# EAGLE design version3f (EAGLE 9.6.2)
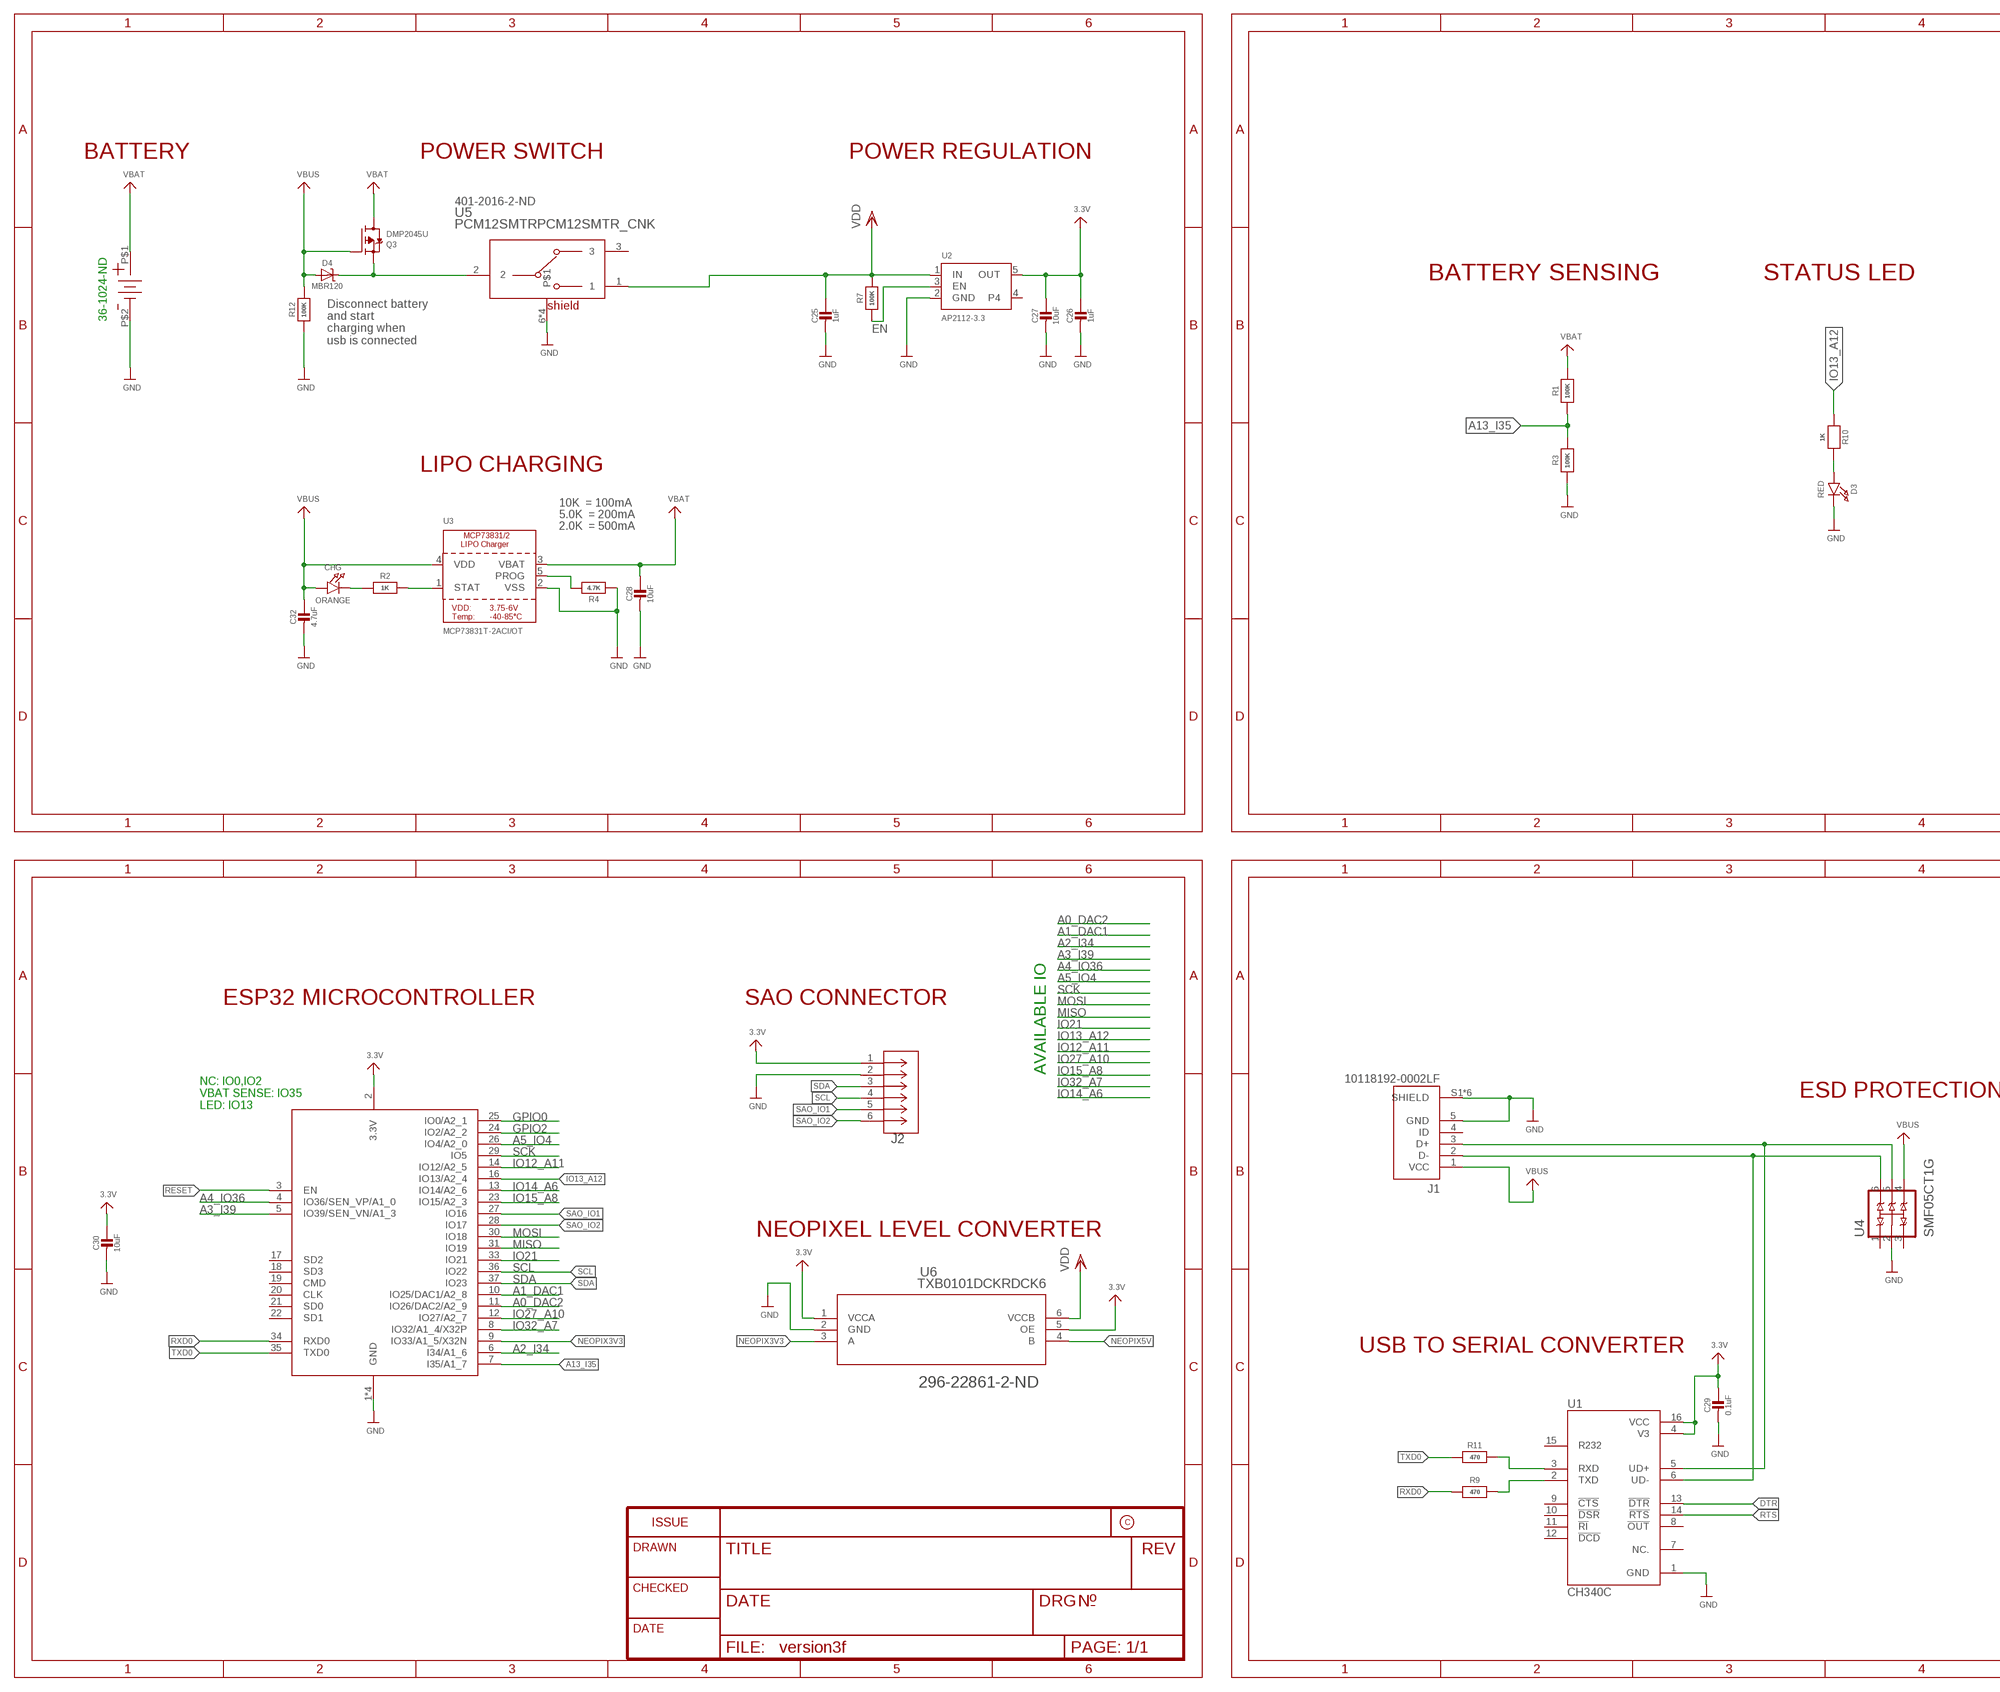
[diagram p0: schematic, sheet 1, part 1 of 2]
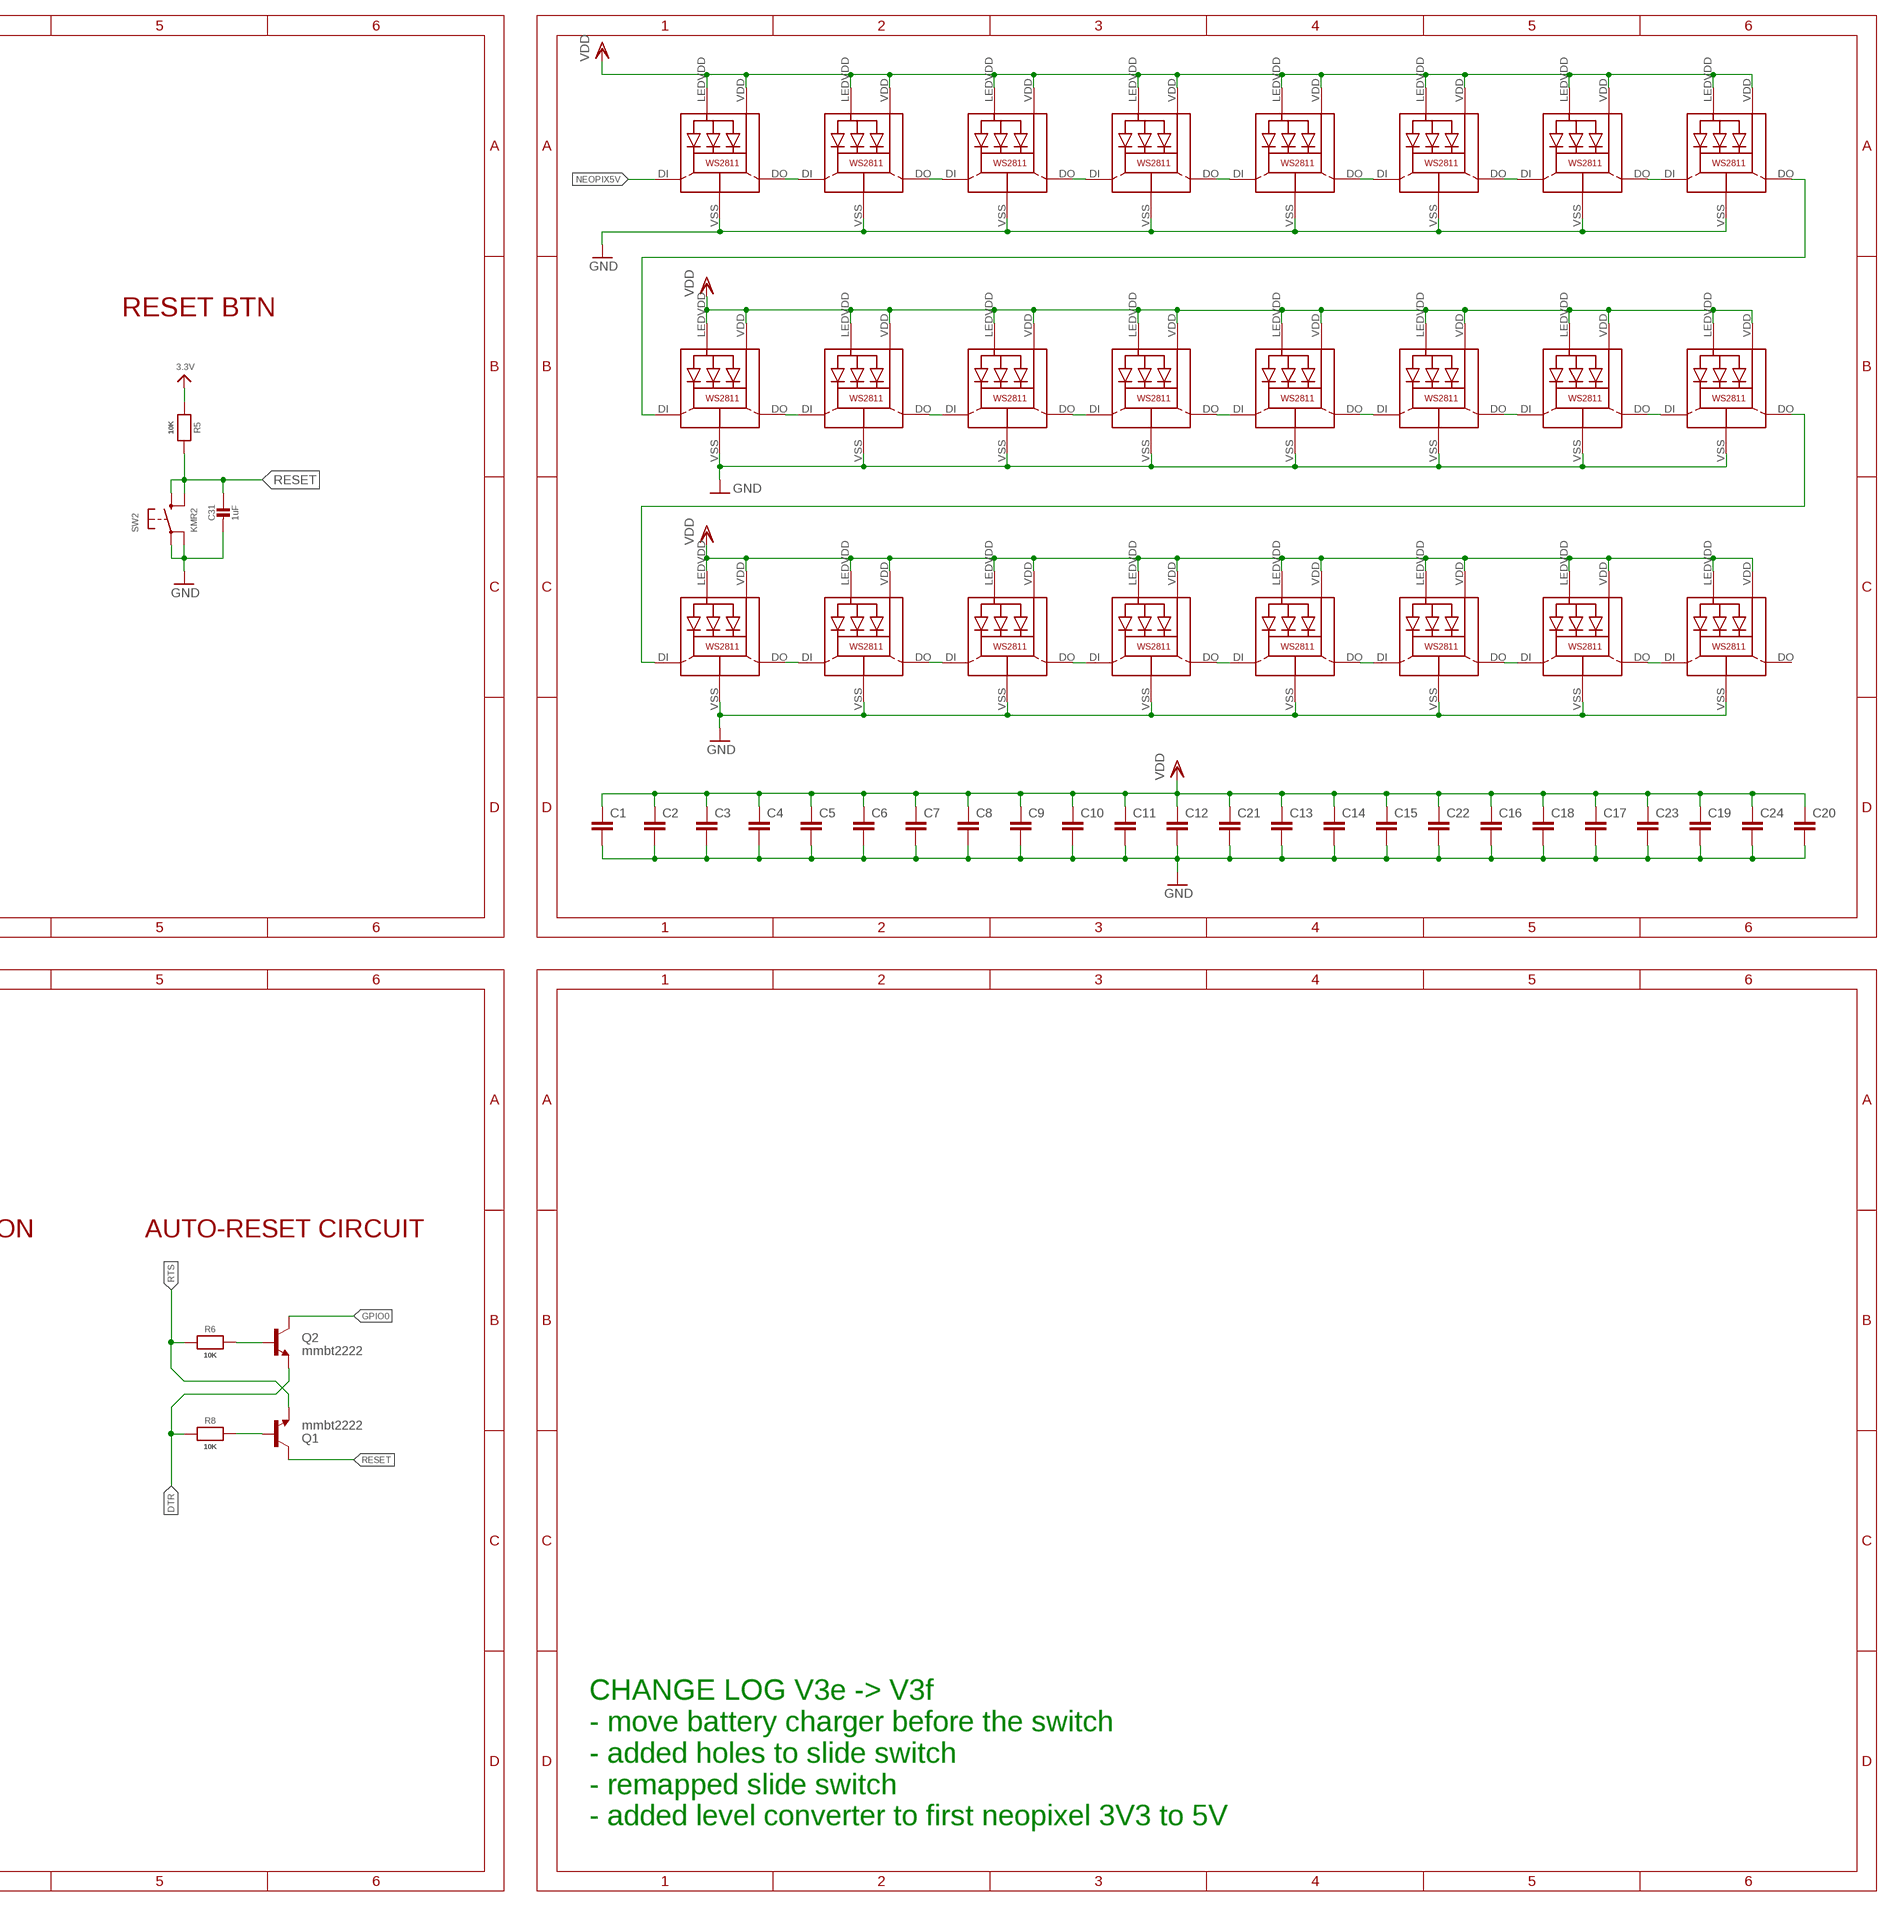
[diagram p1: schematic, sheet 1, part 2 of 2]

## Parts
C1  C-EUC0603  [C0603]
C2  C-EUC0603  [C0603]
C3  C-EUC0603  [C0603]
C4  C-EUC0603  [C0603]
C5  C-EUC0603  [C0603]
C6  C-EUC0603  [C0603]
C7  C-EUC0603  [C0603]
C8  C-EUC0603  [C0603]
C9  C-EUC0603  [C0603]
C10  C-EUC0603  [C0603]
C11  C-EUC0603  [C0603]
C12  C-EUC0603  [C0603]
C13  C-EUC0603  [C0603]
C14  C-EUC0603  [C0603]
C15  C-EUC0603  [C0603]
C16  C-EUC0603  [C0603]
C17  C-EUC0603  [C0603]
C18  C-EUC0603  [C0603]
C19  C-EUC0603  [C0603]
C20  C-EUC0603  [C0603]
C21  C-EUC0603  [C0603]
C22  C-EUC0603  [C0603]
C23  C-EUC0603  [C0603]
C24  C-EUC0603  [C0603]
C25  1uF  CAP_CERAMIC0805-NOOUTLINE  [0805-NO]
C26  1uF  CAP_CERAMIC0603_NO  [0603-NO]
C27  10uF  CAP_CERAMIC0805-NOOUTLINE  [0805-NO]
C28  10uF  CAP_CERAMIC0805-NOOUTLINE  [0805-NO]
C29  0.1uF  CAP_CERAMIC0805-NOOUTLINE  [0805-NO]
C30  10uF  CAP_CERAMIC0805-NOOUTLINE  [0805-NO]
C31  1uF  CAP_CERAMIC0603_NO  [0603-NO]
C32  4.7uF  CAP_CERAMIC0805-NOOUTLINE  [0805-NO]
CHG  ORANGE  LED0805_NOOUTLINE  [CHIPLED_0805_NOOUTLINE]
D3  RED  LED0805_NOOUTLINE  [CHIPLED_0805_NOOUTLINE]
D4  MBR120  DIODE-SCHOTTKYSOD-123  [SOD-123]
J1  10118192-0002LF  [AMPHENOL_10118192-0002LF]
J2  SSW-103-22-F-D-VS-K-TRCON3_SSW-D-DUMZ_HDR_SAI  [CON3_SSW-D-DUMZ_HDR_SAI]
LED1  WS28115050  [WS28115050]
LED2  WS28115050  [WS28115050]
LED3  WS28115050  [WS28115050]
LED4  WS28115050  [WS28115050]
LED5  WS28115050  [WS28115050]
LED6  WS28115050  [WS28115050]
LED7  WS28115050  [WS28115050]
LED8  WS28115050  [WS28115050]
LED9  WS28115050  [WS28115050]
LED10  WS28115050  [WS28115050]
LED11  WS28115050  [WS28115050]
LED12  WS28115050  [WS28115050]
LED13  WS28115050  [WS28115050]
LED14  WS28115050  [WS28115050]
LED15  WS28115050  [WS28115050]
LED16  WS28115050  [WS28115050]
LED17  WS28115050  [WS28115050]
LED18  WS28115050  [WS28115050]
LED19  WS28115050  [WS28115050]
LED20  WS28115050  [WS28115050]
LED21  WS28115050  [WS28115050]
LED22  WS28115050  [WS28115050]
LED23  WS28115050  [WS28115050]
LED24  WS28115050  [WS28115050]
Q1  mmbt2222  TRANSISTOR_NPNSOT23-3  [SOT23-3]
Q2  mmbt2222  TRANSISTOR_NPNSOT23-3  [SOT23-3]
Q3  DMP2045U  MOSFET-P  [SOT23-R]
R1  100K  RESISTOR_0603_NOOUT  [0603-NO]
R2  1K  RESISTOR_0603_NOOUT  [0603-NO]
R3  100K  RESISTOR_0603_NOOUT  [0603-NO]
R4  4.7K  RESISTOR_0603_NOOUT  [0603-NO]
R5  10K  RESISTOR_0603_NOOUT  [0603-NO]
R6  10K  RESISTOR_0603_NOOUT  [0603-NO]
R7  100K  RESISTOR_0603_NOOUT  [0603-NO]
R8  10K  RESISTOR_0603_NOOUT  [0603-NO]
R9  470  RESISTOR_0603_NOOUT  [0603-NO]
R10  1K  RESISTOR_0603_NOOUT  [0603-NO]
R11  470  RESISTOR_0603_NOOUT  [0603-NO]
R12  100K  RESISTOR_0603_NOOUT  [0603-NO]
SW2  KMR2  SWITCH_TACT_SMT4.6X2.8  [BTN_KMR2_4.6X2.8]
U1  CH340C  [SOIC127P600X180-16N]
U2  AP2112-3.3  VREG_SOT23-5  [SOT23-5]
U3  MCP73831T-2ACI/OT  MCP73831/2  [SOT23-5]
U4  SMF05CT1G  [SOT65P210X110-6N]
U5  PCM12SMTRPCM12SMTR_CNK  [PCM12SMTR_CNK]
U6  TXB0101DCKRDCK6  [DCK6]
U$9  1024TR  [1024TR]
X2  ESP32_WROOM32_SKINNY  [WROOM32_SKINNY]

## Nets
3.3V: C26.1 C27.1 C29.1 C30.1 J2.1 R5.1 U1.4(V3) U1.16(VCC) U2.5(OUT) U6.1(VCCA) U6.5(OE) X2.2(3.3V)
A0_DAC2: X2.11(IO26/DAC2/A2_9)
A1_DAC1: X2.10(IO25/DAC1/A2_8)
A2_I34: X2.6(I34/A1_6)
A3_I39: X2.5(IO39/SEN_VN/A1_3)
A4_IO36: X2.4(IO36/SEN_VP/A1_0)
A5_IO4: X2.26(IO4/A2_0)
A13_I35: R1.1 R3.2 X2.7(I35/A1_7)
DTR: Q2.2(E) R8.1 U1.13(!DTR)
EN: R7.1 U2.3(EN)
GND: C1.2 C2.2 C3.2 C4.2 C5.2 C6.2 C7.2 C8.2 C9.2 C10.2 C11.2 C12.2 C13.2 C14.2 C15.2 C16.2 C17.2 C18.2 C19.2 C20.2 C21.2 C22.2 C23.2 C24.2 C25.2 C26.2 C27.2 C28.2 C29.2 C30.2 C31.2 C32.2 D3.C J1.5(GND) J1.S1(SHIELD) J1.S2(SHIELD) J1.S3(SHIELD) J1.S4(SHIELD) J1.S5(SHIELD) J1.S6(SHIELD) J2.2 LED1.VSS(GND) LED2.VSS(GND) LED3.VSS(GND) LED4.VSS(GND) LED5.VSS(GND) LED6.VSS(GND) LED7.VSS(GND) LED8.VSS(GND) LED9.VSS(GND) LED10.VSS(GND) LED11.VSS(GND) LED12.VSS(GND) LED13.VSS(GND) LED14.VSS(GND) LED15.VSS(GND) LED16.VSS(GND) LED17.VSS(GND) LED18.VSS(GND) LED19.VSS(GND) LED20.VSS(GND) LED21.VSS(GND) LED22.VSS(GND) LED23.VSS(GND) LED24.VSS(GND) R3.1 R4.1 R12.1 SW2.A'(P1) SW2.A(P) U1.1(GND) U2.2(GND) U3.2(VSS) U4.2(A) U5.6 U5.7 U5.8 U5.9 U6.2(GND) U$9.P$2 X2.1(GND) X2.15(GND) X2.38(GND) X2.P$1(GND)
GPIO0: Q2.3(C) X2.25(IO0/A2_1)
GPIO2: X2.24(IO2/A2_2)
IO12_A11: X2.14(IO12/A2_5)
IO13_A12: R10.1 X2.16(IO13/A2_4)
IO14_A6: X2.13(IO14/A2_6)
IO15_A8: X2.23(IO15/A2_3)
IO21: X2.33(IO21)
IO27_A10: X2.12(IO27/A2_7)
IO32_A7: X2.8(IO32/A1_4/X32P)
MISO: X2.31(IO19)
MOSI: X2.30(IO18)
N$1: LED1.DO LED2.DI
N$2: LED2.DO LED3.DI
N$3: LED3.DO LED4.DI
N$4: LED4.DO LED5.DI
N$5: LED5.DO LED6.DI
N$6: LED6.DO LED7.DI
N$7: LED7.DO LED8.DI
N$8: LED8.DO LED9.DI
N$9: LED9.DO LED10.DI
N$10: LED10.DO LED11.DI
N$11: LED11.DO LED12.DI
N$12: LED12.DO LED13.DI
N$13: LED13.DO LED14.DI
N$14: LED14.DO LED15.DI
N$15: LED15.DO LED16.DI
N$16: LED16.DO LED17.DI
N$17: LED17.DO LED18.DI
N$18: LED18.DO LED19.DI
N$19: LED19.DO LED20.DI
N$20: LED20.DO LED21.DI
N$21: LED21.DO LED22.DI
N$22: LED22.DO LED23.DI
N$23: LED23.DO LED24.DI
N$24: CHG.C R2.1
N$25: R2.2 U3.1(STAT)
N$26: R9.2 U1.2(TXD)
N$27: R4.2 U3.5(PROG)
N$28: J1.3(D+) U1.5(UD+) U4.5(C4)
N$29: J1.2(D-) U1.6(UD-) U4.6(C5)
N$30: Q1.1(B) R8.2
N$31: Q2.1(B) R6.2
N$32: R11.2 U1.3(RXD)
N$33: D3.A R10.2
N$34: D4.C Q3.2(S) U5.2
NEOPIX3V3: U6.3(A) X2.9(IO33/A1_5/X32N)
NEOPIX5V: LED1.DI U6.4(B)
RESET: C31.1 Q1.3(C) R5.2 SW2.B'(S1) SW2.B(S) X2.3(EN)
RTS: Q1.2(E) R6.1 U1.14(!RTS)
RXD0: R9.1 X2.34(RXD0)
SAO_IO1: J2.5 X2.27(IO16)
SAO_IO2: J2.6 X2.28(IO17)
SCK: X2.29(IO5)
SCL: J2.4 X2.36(IO22)
SDA: J2.3 X2.37(IO23)
TXD0: R11.1 X2.35(TXD0)
VBAT: C28.1 Q3.3(D) R1.2 U3.3(VBAT) U$9.P$1
VBUS: C32.1 CHG.A D4.A J1.1(VCC) Q3.1(G) R12.2 U3.4(VDD) U4.4(C3)
VDD: C1.1 C2.1 C3.1 C4.1 C5.1 C6.1 C7.1 C8.1 C9.1 C10.1 C11.1 C12.1 C13.1 C14.1 C15.1 C16.1 C17.1 C18.1 C19.1 C20.1 C21.1 C22.1 C23.1 C24.1 C25.1 LED1.LEDVDD LED1.VDD LED2.LEDVDD LED2.VDD LED3.LEDVDD LED3.VDD LED4.LEDVDD LED4.VDD LED5.LEDVDD LED5.VDD LED6.LEDVDD LED6.VDD LED7.LEDVDD LED7.VDD LED8.LEDVDD LED8.VDD LED9.LEDVDD LED9.VDD LED10.LEDVDD LED10.VDD LED11.LEDVDD LED11.VDD LED12.LEDVDD LED12.VDD LED13.LEDVDD LED13.VDD LED14.LEDVDD LED14.VDD LED15.LEDVDD LED15.VDD LED16.LEDVDD LED16.VDD LED17.LEDVDD LED17.VDD LED18.LEDVDD LED18.VDD LED19.LEDVDD LED19.VDD LED20.LEDVDD LED20.VDD LED21.LEDVDD LED21.VDD LED22.LEDVDD LED22.VDD LED23.LEDVDD LED23.VDD LED24.LEDVDD LED24.VDD R7.2 U2.1(IN) U5.1 U6.6(VCCB)
Unconnected: J1.4(ID) LED24.DO U1.7(NC.) U1.8(!OUT) U1.9(!CTS) U1.10(!DSR) U1.11(!RI) U1.12(!DCD) U1.15(R232) U2.4 U4.1(C1) U4.3(C2) U5.3 X2.17(SD2) X2.18(SD3) X2.19(CMD) X2.20(CLK) X2.21(SD0) X2.22(SD1)

## Notes on the sheet
- BATTERY | POWER SWITCH | POWER REGULATION
- 401-2016-2-ND
- BATTERY SENSING | STATUS LED | RESET BTN
- 36-1024-ND
- Disconnect battery 
  and start 
  charging when 
  usb is connected
- LIPO CHARGING
- 10K  = 100mA
- 5.0K  = 200mA
- 2.0K  = 500mA
- ESP32 MICROCONTROLLER | SAO CONNECTOR
- AVAILABLE IO
- ESD PROTECTION | AUTO-RESET CIRCUIT
- NC: IO0,IO2
  VBAT SENSE: IO35
  LED: IO13
- NEOPIXEL LEVEL CONVERTER
- USB TO SERIAL CONVERTER
- 296-22861-2-ND
- CHANGE LOG V3e -> V3f
  - move battery charger before the switch
  - added holes to slide switch
  - remapped slide switch
  - added level converter to first neopixel 3V3 to 5V

## Library data of the parts
C1-C24 = rcl:C-EU: CAPACITOR, European symbol
C25-C32 = microbuilder:CAP_CERAMIC: Ceramic Capacitors For new designs, use the packages preceded by an '_' character since they are more reliable: The following footprints should be used on most boards: _0402 - Standard footprint for regular board layouts _0603 - Standard footprint for regular board layouts _0805 - Standard footprint for regular board layouts _1206 - Standard footprint for regular board layouts For extremely tight-pitch boards where space is at a premium, the following 'micro-pitch' footprints can be used (smaller pads, no silkscreen outline, etc.): _0402MP - Micro-pitch footprint for very dense/compact boards _0603MP - Micro-pitch footprint for very dense/compact boards _0805MP - Micro-pitch footprint for very dense/compact boards _1206MP - Micro-pitch footprint for very dense/compact boards
CHG D3 = microbuilder:LED: LED 0603 - 0603 Surface Mount Package 2mA: Green LED - Low Power (3.9mcd, 2ma, 1.7Vf) - Digikey: 475-2709-2-ND Orange LED - Low Power (9.8mcd, 2ma, 1.8Vf) - Digikey: 475-1194-2-ND Red LED - Low Power (5mcd, 2ma, 1.8Vf) - Digikey: 475-1195-2-ND Yellow LED - Low Power (7mcd, 2ma, 1.8Vf) - Digikey: 475-1196-2-ND 5mA: Blue LED - Low Power (17mcd, 5ma, 2.9Vf) - Digikey: LNJ937W8CRACT-ND 0805 - 0805 Surface Mount Package 2mA: Red LED (8.8mcd, 2mA, 1.8Vf, Clear) - Low Power [Digikey: 475-2510-1-ND] Green LED (5mcd, 2mA, 1.8Vf, Clear) - Low Power [Digikey: 475-2730-1-ND] Yellow LED (11.3mcd, 2mA, 1.8Vf, Clear) - Low Power [Digikey: 475-2555-1-ND] 20mA: Red LED (104mcd, 20mA, Diffused) - LS R976 [Digikey: 475-1278-6-ND] Red LED (12mcd, 20mA, 2.0Vf, Clear) - APT2012EC [Digikey: 754-1128-1-ND] Green LED (15mcd, 20mA, 2.2Vf, Clear) - APT2012GC [Digikey: 754-1131-1-ND] Orange LED (160mcd, 20mA, 2.1Vf, Clear) - APT2012SECK [Digikey: 754-1130-1-ND] 1206 - 1206 Surface Mount Package Green LED (26mcd, 20mA, Diffused) - LG N971 [Digikey: 475-1407-6-ND] Red LED (15mcd, 20mA, Diffused) - LH N974 [Digikey: 475-1416-6-ND] Cree - Cree High-Power Surface Mount LEDs XPEBWT-L1-0000-00D50 - White 111lm 350mA 2.9Vf 6200K 110° XTEAWT-00-0000-00000LEE3 - White 114lm 350mA 2.85Vf 5000K 115° Everlight - Everlight 45-21 Series Surface Mount LEDs 45-21/QK2C-B2832AC2CB2/2T - Warm White 2000mcd 20mA 3.25Vf 3050K 120° 45-21/LK2C-B38452C4CB2/2T - Nuetral White 2000mcd 20mA 3.25Vf 4150K 120° 45-21/LK2C-B50634C6CB2/2T - Cold White 2200mcd 20mA 3.25Vf 5650K 120° PLCC2 Reverse Mount LS T77K-J1L2-1-0-2-R18-Z - Red 11.25mcd 2mA 1.8Vf 630nm 120° LO T77K-L1M2-24-Z - Orange 19.6mcd 2mA 1.8Vf 606nm 120° LY T77K-K2M1-26-Z - Yellow 15.7mcd 2mA 1.8Vf 587nm 120°
D4 = microbuilder:DIODE-SCHOTTKY
J1 = 10118192-0002LF:10118192-0002LF: USB - micro B USB 2.0 Receptacle Connector 5 Position Surface Mount, Right Angle; DESCRIPTION: Micro USB 2.0, Input Output Connectors, B TYPE RECEPTACLE without flange; DIGI-KEY_PART_NUMBER: 609-5379-1-ND; MF: Amphenol ICC (FCI); MP: 10118192-0002LF; PACKAGE: None; PURCHASE-URL: https://pricing.snapeda.com/search/part/10118192-0002LF/?ref=eda
J2 = SSW-103-22-F-D-VS-K-TR:SSW-103-22-F-D-VS-K-TR; COPYRIGHT: Copyright (C) 2022 Ultra Librarian. All rights reserved.; DIGI-KEY_PART_NUMBER_1: SAM14622CT-ND; DIGI-KEY_PART_NUMBER_2: SAM14622DKR-ND; DIGI-KEY_PART_NUMBER_3: SAM14622TR-ND; MANUFACTURER_PART_NUMBER: SSW-103-22-F-D-VS-K-TR; MFR_NAME: Samtec Inc
LED1-LED24 = microbuilder:WS28115050
Q1 Q2 = SparkFun:TRANSISTOR_NPN: Transistor NPN BJT configuration in SOT23 package. MMBT2222 is the common NPN we use. Double check BCE configuration again layout.
Q3 = microbuilder:MOSFET-P: P-Channel Mosfet LEGEND VDS: Voltage Drain-Source ID: Drain Current RDS(ON): Drain-Source On-State Resistance VGS(TH): Gate-Source Threshold Voltage CISS: Drain-Source Input Capacitance SOT-23 Name VDS ID RDS(ON) VGS(TH) CISS Order Number IRLML5103 30V 760mA 600 mOhm -- 75pF @ 25V Digikey: IRLML5103PBFCT-ND IRLML6401 12V 4.3A 50 mOhm 950mV @ 250µA 830pF @ 10V Digikey: IRLML6401PBFTR-ND NTR0202PL 20V 400mA 800 mOhm 2.3V @ 250uA 70pF @ 5V Digikey: NTR0202PLT1GOSTR-ND NTR4101PT1G 20V 1.8A 85 mOhm 1.2V @ 250uA 675pF @ 10V Digikey: NTR4101PT1GOSCT-ND DMP2004K 20V 600mA 900 mOhm 1V @ 250uA 175pF @ 16V Digikey: DMP2004KDICT-ND PMV65XP 20V 3.9A 76 mOhm 950mV @ 1mA 725pF @ 20V Digikey: 568-2358-2-ND TO-252 Name VDS ID RDS(ON) VGS(TH) CISS Order Number AOD417 30V 25A 34 mOhm 3V @ 250µA 920pF @ 15V Digikey: 785-1106-2-ND PowerPak Name VDS ID RDS(ON) VGS(TH) CISS Order Number AON7401 30V 12A 14 mOhm 3V @ 250µA 2600pF @ 15V Digikey: 785-1302-1-ND
R1-R12 = microbuilder:RESISTOR: Resistors For new designs, use the packages preceded by an '_' character since they are more reliable: The following footprints should be used on most boards: _0402 - Standard footprint for regular board layouts _0603 - Standard footprint for regular board layouts _0805 - Standard footprint for regular board layouts _1206 - Standard footprint for regular board layouts For extremely tight-pitch boards where space is at a premium, the following 'micro-pitch' footprints can be used (smaller pads, no silkscreen outline, etc.): _0402MP - Micro-pitch footprint for very dense/compact boards _0603MP - Micro-pitch footprint for very dense/compact boards _0805MP - Micro-pitch footprint for very dense/compact boards _1206MP - Micro-pitch footprint for very dense/compact boards
SW2 = microbuilder:SWITCH_TACT_SMT: SMT Tact Switches 6x6mm - Digikey: P12940SCT-ND KMR2 (4.6x2.8mm) - Digikey: 401-1426-1-ND EVQ-PQHB55 - Light Touch, 160GF (4.5x4.5mm) - Digikey: P8090SCT-ND KMT0 - KMT021 NGJ LHS (etc.) IP68/Waterproof - Digikey: CKN10289CT-ND
U1 = CH340C:CH340C: USB to serial chip CH340 Check prices <https://pricing.snapeda.com/parts/CH340C/WCH/view-part?ref=eda>; AVAILABILITY: Not in stock; DESCRIPTION: USB to serial chip CH340; MF: WCH; MP: CH340C; PACKAGE: None; PRICE: None
U2 = microbuilder:VREG_SOT23-5: SOT23-5 Fixed Voltage Regulators Part Current Out V Out V In V Dropout θJA (°C/W) TJ (°C) Digikey Part No. ADP121 150mA 3.3V 3.4-5.5V 0.09V @ 150mA -- -- ADP121-AUJZ33R7CT-ND ADP121 150mA 3.0V 3.1-5.5V 0.09V @ 150mA -- -- ADP121-AUJZ30R7CT-ND ADP122 300mA 3.3V 3.4-5.5V 0.085V @ 300mA -- -- ADP122AUJZ-3.3-R7CT-ND ADP1712 300mA 3.3V 3.5-5.5V 0.17V @ 300mA -- -- ADP1712AUJZ-3.3-R7TR-ND AP7311 (Low Cost) 150mA 3.3V 3.5-6V 0.15V @ 150mA -- -- AP7311-33WG-7DICT-ND LD39015M18R 150mA 1.8V 1.9V-5.5V 0.08V @ 100mA -- -- 497-6977-1-ND LP2985A-33DBVR 150mA 3.3V 3.3-16V 0.28V @ 150mA 206 150 296-18479-1-ND MCP1824T-3302E/OT 300mA 3.3V 3.5V-6V 0.2V @ 300mA -- -- MCP1824T-3302E/OTCT-ND MIC5205-2.5YM5 TR 150mA 2.5V 2.7-16V 0.165V @ 150mA -- -- 576-1257-2-ND MIC5205-3.0YM5 TR 150mA 3.0V 3.2V-16V 0.165V @ 150mA -- -- 576-1258-2-ND MIC5205-3.3YM5 TR 150mA 3.3V 3.5V-16V 0.165V @ 150mA -- -- 576-1259-2-ND TPS780330220 150mA 3.3V+2.2V 3.6-5.5V 250mV Max -- -- 296-23332-1-ND TDA3663/N1,135 100mA 3.3V 3.5-45V 0.18V @ 50mA -- -- 568-5343-1-ND Max operating temp can be calculated using θJA, TJ (max junction temperature), and power in watts. Set the "Maximum Ambient Temperature" until it reaches TJ ("Max Junction Temperature"), which is the absolute limit for safe use of the regulator: Heat Sink Temperature Calculator <http://www.daycounter.com/Calculators/Heat-Sink-Temperature-Calculator.phtml> For example, With 12V source into a 3.3V LP2985 and a 30mA load, we are dissipating (12V-3.3V) * 0.03A = 0.261W. With a θJA of 206 °C/W, a TJ of 150°C, and 261mW we can safely use the chip without a heat sink up to 75°C (=147.1°C Junction Temperature).
U3 = microbuilder:MCP73831/2: MCP73831/2 LIPO Charger VDD: 3.75 - 6V Temp -40 - 85°C Programmable Charge Rate: 15-500mA NOTE: STAT is a tri-state logic output on the MCP73831 and an open-drain output on the MCP73832. SOT23-5 with 4.2V output and tri-state logic on STAT = MCP73831T-2ACI/OT
U4 = SMF05CT1G:SMF05CT1G: SMF05C Series 7.2 V 100 W 5-Line Transient Voltage Suppressor Array - SC-88 Check prices <https://pricing.snapeda.com/parts/SMF05CT1G/ON%20Semiconductor/view-part?ref=eda>; AVAILABILITY: In Stock; DESCRIPTION: 12.5V Clamp 8A (8/20µs) Ipp Tvs Diode Surface Mount SC-88/SC70-6/SOT-363; MF: ON Semiconductor; MP: SMF05CT1G; PACKAGE: SC-88-6 ON Semiconductor; PRICE: None; PURCHASE-URL: https://pricing.snapeda.com/search/part/SMF05CT1G/?ref=eda
U5 = 401-2016-2-ND:PCM12SMTR; COPYRIGHT: Copyright (C) 2022 Ultra Librarian. All rights reserved.; DIGI-KEY_PART_NUMBER_1: 401-2016-2-ND; DIGI-KEY_PART_NUMBER_2: 401-2016-1-ND; DIGI-KEY_PART_NUMBER_3: 401-2016-6-ND; DIGI-KEY_PART_NUMBER_4: 2266-PCM12SMTR-ND; MANUFACTURER_PART_NUMBER: PCM12SMTR; MFR_NAME: C&K
U6 = TXB0101DCKR:TXB0101DCKR; COPYRIGHT: Copyright (C) 2022 Ultra Librarian. All rights reserved.; DIGI-KEY_PART_NUMBER_1: 296-22861-1-ND; DIGI-KEY_PART_NUMBER_2: 296-22861-2-ND; DIGI-KEY_PART_NUMBER_3: 296-22861-6-ND; DIGI-KEY_PART_NUMBER_4: 2156-TXB0101DCKR-ND; MANUFACTURER_PART_NUMBER: TXB0101DCKR; MFR_NAME: Texas Instruments
U$9 = ww_devkit:1024TR
X2 = microbuilder:ESP32_WROOM32

## Board
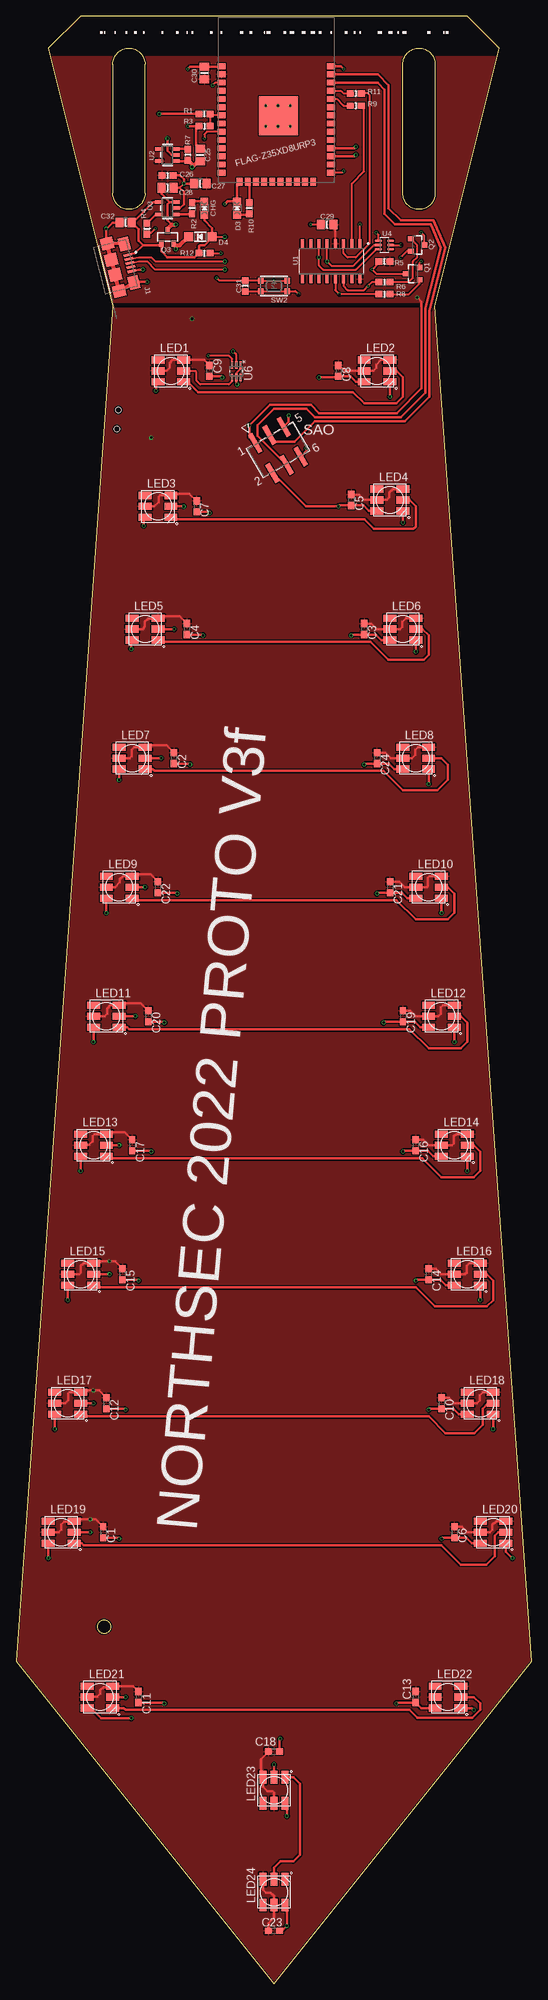
[diagram p2: board, top side]
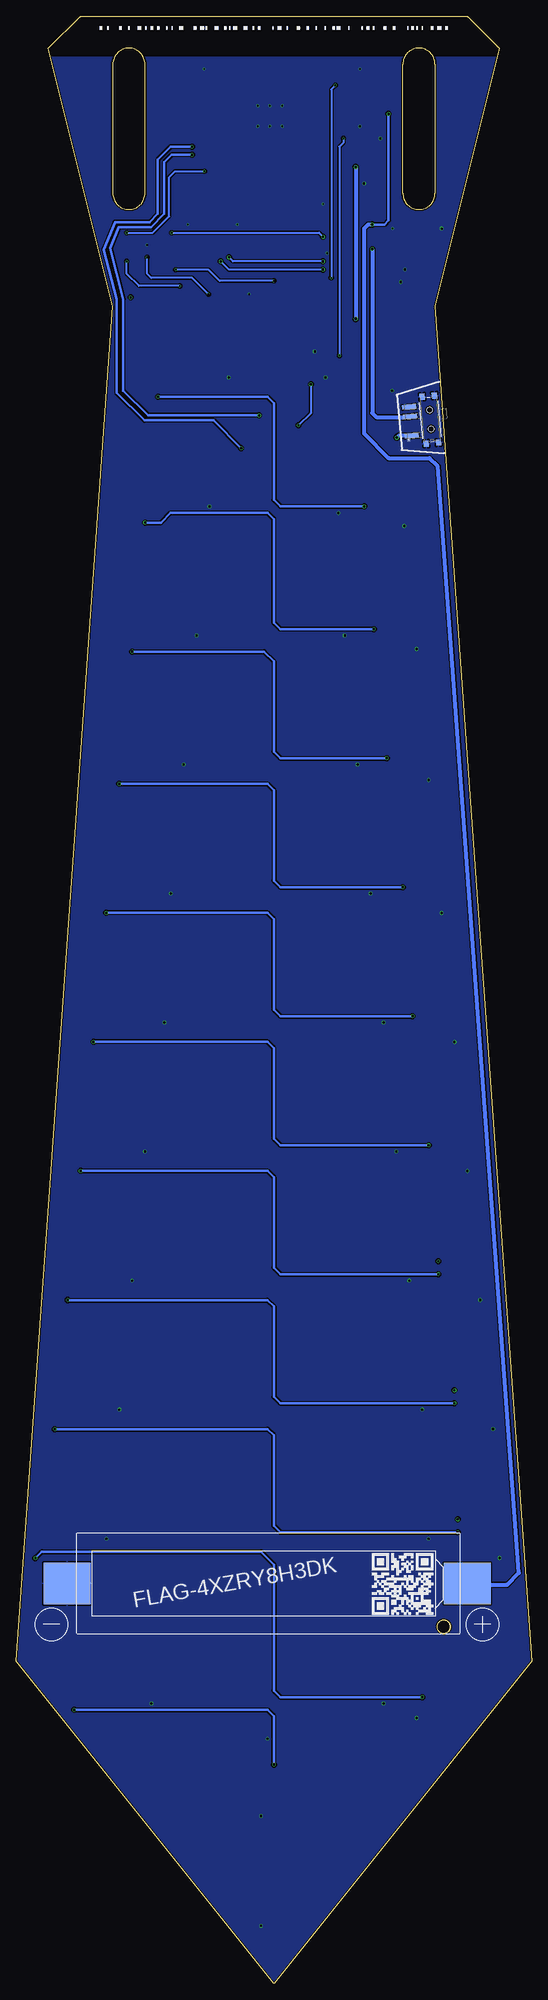
[diagram p3: board, bottom side, seen from below]

Size 80 x 305 mm. Coordinates in mm from the lower left corner, seen from the top.
Outline: 15,260 0,50 40,0 80,50 65,260 75,300 70,305 10,305 5,300 15,260
Outline: 15,297.54 15,277.54 arc180 20,277.54 20,297.54 arc180 15,297.54
Outline: 65,297.54 65,277.54 arc-180 60,277.54 60,297.54 arc-180 65,297.54
Copper layers (1*16): Top 0.035mm / dielectric 0.2mm / Bottom 0.035mm
Design rules "JLC_2Layer_(workInProgress)": minimum track width 3.5mil, minimum drill 0.2mm, track to track 3.5mil, track to pad 5mil, pad to pad 5mil, via to via 5mil, smd to smd 0mil, copper to edge 0.2mm, drill to drill 0.2mm, minimum pad ring 3mil, minimum via ring 3mil, stop-mask expansion 0mil, vias tented up to drill 100mil, thermal gap 10mil

### Footprints (pad centres in the part's own frame; a part is rotated, then mirrored left to right if it is on the bottom)
C0603 = smd 1.1 x 1: 1 -0.85,0; 2 0.85,0
0805-NO = smd 1.24 x 1.5: 1 -0.95,0; 2 0.95,0
0603-NO = smd 1.075 x 1: 1 -0.85,0; 2 0.85,0
CHIPLED_0805_NOOUTLINE = smd 1.2 x 1.2: A 0,-1.05; C 0,1.05
SOD-123 = smd 1.4 x 1.4: A 1.85,0; C -1.85,0
AMPHENOL_10118192-0002LF = smd 0.4 x 1.35: 1 -1.3,0; 2 -0.65,0; 3 0,0; 4 0.65,0; 5 1.3,0 | smd 2.1 x 1.6: S1 -3.1,-0.125; S2 3.1,-0.125 | smd 1.8 x 1.9: S3 -3.8,-2.675; S6 3.8,-2.675 | smd 1.9 x 1.9: S4 -1.2,-2.675; S5 1.2,-2.675
CON3_SSW-D-DUMZ_HDR_SAI = smd 0.737 x 3.251: 1 2.54,-2.667; 2 2.54,2.667; 3 0,-2.667; 4 0,2.667; 5 -2.54,-2.667; 6 -2.54,2.667
WS28115050 = smd 2 x 1.1: DI 2,0; DO 2,-1.7; LEDVDD -2,0; NC -2,1.7; VDD 2,1.7; VSS -2,-1.7
SOT23-3 = smd 0.8 x 0.9: 1 -0.95,-1; 2 0.95,-1; 3 0,1.1
SOT23-R = smd 0.635 x 1.016: 1 -0.95,-1; 2 0.95,-1; 3 0,1
BTN_KMR2_4.6X2.8 = smd 0.9 x 0.9: A 2.05,0.8; A' -2.05,0.8; B 2.05,-0.8; B' -2.05,-0.8
SOIC127P600X180-16N = smd 1.31 x 0.62: 1 -2.75,4.445; 2 -2.75,3.175; 3 -2.75,1.905; 4 -2.75,0.635; 5 -2.75,-0.635; 6 -2.75,-1.905; 7 -2.75,-3.175; 8 -2.75,-4.445; 9 2.75,-4.445; 10 2.75,-3.175; 11 2.75,-1.905; 12 2.75,-0.635; 13 2.75,0.635; 14 2.75,1.905; 15 2.75,3.175; 16 2.75,4.445
SOT23-5 = smd 0.55 x 1.2: 1 -0.95,-1.3; 2 0,-1.3; 3 0.95,-1.3; 4 0.95,1.3; 5 -0.95,1.3
SOT65P210X110-6N = smd 1.06 x 0.39: 1 -0.935,0.65; 2 -0.935,0; 3 -0.935,-0.65; 4 0.935,-0.65; 5 0.935,0; 6 0.935,0.65
PCM12SMTR_CNK = smd 2.21 x 0.762: 1 3.101,2.25; 2 3.101,-0.75; 3 3.101,-2.25 | smd 0.813 x 0.991: 6 -0.965,3.65; 7 0.965,3.65; 8 -0.965,-3.65; 9 0.965,-3.65 | hole 0.9: 0,1.499; 0,-1.499
DCK6 = smd 1.168 x 0.356: 1 -0.978,0.65; 2 -0.978,0; 3 -0.978,-0.65; 4 0.978,-0.65; 5 0.978,0; 6 0.978,0.65
1024TR = smd 7.3 x 6.4: P$1 3.65,0; P$2 65.7,0 | hole 2: 7.315,6.706
WROOM32_SKINNY = smd 1.2 x 0.9: 1 -8.5,5; 2 -8.5,3.73; 3 -8.5,2.46; 4 -8.5,1.19; 5 -8.5,-0.08; 6 -8.5,-1.35; 7 -8.5,-2.62; 8 -8.5,-3.89; 9 -8.5,-5.16; 10 -8.5,-6.43; 11 -8.5,-7.7; 12 -8.5,-8.97; 13 -8.5,-10.24; 14 -8.5,-11.51; 25 8.5,-11.51; 26 8.5,-10.24; 27 8.5,-8.97; 28 8.5,-7.7; 29 8.5,-6.43; 30 8.5,-5.16; 31 8.5,-3.89; 32 8.5,-2.62; 33 8.5,-1.35; 34 8.5,-0.08; 35 8.5,1.19; 36 8.5,2.46; 37 8.5,3.73; 38 8.5,5 | smd 0.9 x 1.2: 15 -5.7,-12.9; 16 -4.43,-12.9; 17 -3.16,-12.9; 18 -1.89,-12.9; 19 -0.62,-12.9; 20 0.65,-12.9; 21 1.92,-12.9; 22 3.19,-12.9; 23 4.46,-12.9; 24 5.73,-12.9 | smd 6 x 6: P$1 0.34,-2.7

### Placement (x,y rotation side)
C1  13.5,70 270 top
C2  24.5,190 270 top
C3  54,210 270 top
C4  26.5,210 270 top
C5  52,230 270 top
C6  68,70 270 top
C7  28,229 270 top
C8  50,250 270 top
C9  30,250 270 top
C10  66,90 270 top
C11  19,44.46 270 top
C12  14,90 270 top
C13  62,44.46 270 top
C14  64,110 270 top
C15  16.5,110 270 top
C16  62,130 270 top
C17  18,130 270 top
C18  40,36 0 top
C19  60,150 270 top
C20  20.5,150 270 top
C21  58,170 270 top
C22  22,170 270 top
C23  40,8.23 0 top
C24  56,190 270 top
C25  28.57,283.49 90 top
C26  23.49,280.31 0 top
C27  28.57,279.05 180 top
C28  23.49,278.41 0 top
C29  48.26,272.69 180 top
C30  29.2,296.19 90 top
C31  35.55,263.17 270 top
C32  17,273 180 top
CHG  29.2,275.24 0 top
D3  34.28,275.24 0 top
D4  28.57,270.79 0 top
J1  17.65,266.73 284 top
J2  40.63,237.77 210 top
LED1  24,250 0 top
LED2  56,250 0 top
LED3  22,229 0 top
LED4  58,230 0 top
LED5  20,210 0 top
LED6  60,210 0 top
LED7  18,190 0 top
LED8  62,190 0 top
LED9  16,170 0 top
LED10  64,170 0 top
LED11  14,150 0 top
LED12  66,150 0 top
LED13  12,130 0 top
LED14  68,130 0 top
LED15  10,110 0 top
LED16  70,110 0 top
LED17  8,90 0 top
LED18  72,90 0 top
LED19  7,70 0 top
LED20  74,70 0 top
LED21  13,44.46 0 top
LED22  67,44.46 0 top
LED23  40,30 90 top
LED24  40,14.23 90 top
Q1  61.59,265.07 90 top
Q2  62.23,269.52 270 top
Q3  23.49,270.79 0 top
R1  29.2,289.84 180 top
R2  27.3,275.24 270 top
R3  29.2,287.94 0 top
R4  20.32,272.06 90 top
R5  57.14,266.98 180 top
R6  57.14,263.81 0 top
R7  26.66,283.49 270 top
R8  57.14,261.9 0 top
R9  52.7,291.11 0 top
R10  36.19,275.24 270 top
R11  52.7,293.01 0 top
R12  29.2,268.25 180 top
SW2  40,263.17 180 top
U1  48.89,266.98 270 top
U2  23.49,283.49 90 top
U3  23.49,275.24 90 top
U4  57.14,269.52 180 top
U5  15.74,242.47 185 bottom
U6  34.16,249.96 270 top
U$9  6.34,62.06 180 bottom
X2  40.36,292.24 0 top

### Tracks (layer width: path | path; a pad name or v marks a point on that pad's centre or on a via)
3.3V  (via drill 0.35)
  Top 0.254: C26.1 22.64,279.93
  Top 0.305: U1.4 49.52,272.38 C29.1 | v34.28,247.93 34.16,248.06 U6.5 34.16,249.71 34.81,250.36 U6.1
  Top 0.406: J2.1 36.19,239.72 v36.19,241.58 39.37,244.75 45.72,244.75 46.98,243.49 59.05,243.49 62.86,247.3 62.86,260.76 v62.23,261.39
  Bottom 0.305: v34.28,247.93 34.28,243.49 v36.19,241.58
  pour Top (isolate 0.203): -4.45,260.63 81.91,260.63 81.91,298.73 -4.45,298.73
A13_I35
  Top 0.305: X2.7 30.27,289.62 R1.1 R3.2
DTR  (via drill 0.25)
  Top 0.305: U1.13 49.52,262.53 v50.16,261.9 R8.1 | v59.69,267.62 60.64,268.57 Q2.2
  Bottom 0.305: v50.16,261.9 52.7,264.44 59.05,264.44 59.69,265.07 v59.69,267.62
EN
  Top 0.406: U2.3 26.56,284.44 R7.1
GND  (via drill 0.25, 0.35)
  Top 0.305: C31.2 37.9,262.32 SW2.A SW2.A' 43.34,262.37 v43.81,261.9 | C29.2 v45.72,272.69 | U1.1 v53.34,272.69 | U4.2 v59.69,269.52 | R12.1 v31.74,268.25 | R4.1 20.53,271.43 20.95,271.43 v21.59,272.06 | v40.63,287.94 40.7,288 X2.P$1 | U6.2 34.16,252.5 v33.65,253.01
  Top 0.406: C2.2 27,189.15 v27,189 | C4.2 29,209.15 v29,209 | C7.2 30,228.15 v30,228 | C22.2 25,169.15 v25,169 | C17.2 21,129.15 v21,129 | C15.2 19,109.15 v19,109 | C12.2 16.85,89.15 v17,89 | C1.2 16,69.15 v16,69 | v23,43.46 22.85,43.61 C11.2 | v41,38 40.85,37.85 C18.2 | C20.2 23,149.15 v23,149 | LED19.VSS v5,66 | v17.87,41.19 13.2,41.19 11.64,42.76 LED21.VSS | LED17.VSS v6,86 | LED15.VSS v8,106 | LED13.VSS v10,126 | LED11.VSS v12,146 | LED9.VSS v14,166 | LED7.VSS 15.96,188.26 v15.96,186.61 | LED5.VSS 17.87,208.17 v17.87,206.93 | LED3.VSS 19.77,227.07 v19.77,225.97 | LED1.VSS 21.68,247.98 v21.68,246.93 | LED22.VSS 62.85,42.76 C13.2 59.15,43.61 v59,43.46 | C23.2 41.23,8.23 v42,9 42,11.93 LED24.VSS | LED23.VSS 42,27.7 v42,26 | LED14.VSS 64.7,128.3 63.85,129.15 C16.2 60.15,129.15 v60,129 | LED12.VSS 62.7,148.3 61.85,149.15 C19.2 57.15,149.15 v57,149 | LED16.VSS 66.7,108.3 65.85,109.15 C14.2 62.15,109.15 v62,109 | LED2.VSS 52.7,248.3 51.85,249.15 C8.2 49.85,249 v47,249 | C9.2 31.85,249.15 v32,249 | LED20.VSS 70.7,68.3 69.85,69.15 C6.2 66.15,69.15 v66,69 | LED18.VSS 68.7,88.3 67.85,89.15 C10.2 64.15,89.15 v64,89 | LED10.VSS 60.7,168.3 59.85,169.15 C21.2 56.15,169.15 v56,169 | LED8.VSS 58.7,188.3 57.85,189.15 C24.2 54.15,189.15 v54,189 | LED6.VSS 56.7,208.3 55.85,209.15 C3.2 52.15,209.15 v52,209 | LED4.VSS 54.7,228.3 53.85,229.15 C5.2 50.15,229.15 v50,229 44.96,229 J2.2 | J1.5 19.05,265.71 v19.68,265.71 | C26.2 25.39,280.31 26.03,279.68 v26.03,279.05 | C27.2 v26.03,279.05 | C28.2 25.39,278.41 | 25.39,278.41 v26.03,279.05 | X2.15 34.28,278.97 D3.C 32.8,276.29 v32.38,275.87 | U3.2 25.39,275.24 26.03,275.87 26.03,277.77 25.39,278.41
  Top 0.406: U2.2 24.12,283.49 23.49,284.12 v23.49,286.03 | C25.2 27.94,285.07 27.94,287.51 R3.1 v26.66,287.94 | X2.1 31.76,297.14 C30.2 26.98,297.14 v26.66,296.82 | X2.38 50.38,297.24 v50.8,296.82 | J1.S3 13.96,269.93 13.96,272 | 13.96,272 v13.96,272.06 | J1.S2 18.39,263.81 v20.32,263.81 | 13.96,272 14.96,273 C32.2
  Top 0.61: J1.S1 J1.S3 J1.S4 J1.S5 J1.S6 J1.S2
  other vias: 40.63,291.11 38.73,287.94 42.54,287.94 42.54,291.11 38.73,291.11
  pour Bottom (isolate 0.203): -1.27,-3.53 84.45,-3.53 84.45,298.73 -1.27,298.73
GPIO0  (via drill 0.25)
  Top 0.305: Q2.3 63.33,270.96 v62.86,271.43 | v50.8,280.95 50.58,280.73 X2.25
  Bottom 0.305: v62.86,271.43 58.8,271.43 56.26,273.96 56.26,280.06 55.37,280.95 v50.8,280.95
IO13_A12
  Top 0.406: X2.16 36.19,279.08 R10.1
N$1
  Top 0.406: LED1.DO 26.63,248.3 28.2,246.73 52.27,246.73 54,245 59,245 60,246 60,249 59,250 LED2.DI
N$2  (via drill 0.35)
  Top 0.406: LED2.DO v58,246 | v26,229 LED3.DI
  Bottom 0.406: v58,246 41,246 40,245 40,230 39,229 v26,229
N$3
  Top 0.406: LED4.DI 61,230 62,229 62,225.89 61.64,225.52 55.48,225.52 54,227 25,227 24.7,227.3 LED3.DO
N$4  (via drill 0.35)
  Top 0.406: LED4.DO v60,226.51 | LED5.DI v24.5,210
  Bottom 0.406: v60,226.51 57.49,226.51 56,228 41,228 40,227 40,211 39,210 v24.5,210
N$5
  Top 0.406: LED5.DO 22.3,208 55,208 57.75,205.25 63.25,205.25 64,206 64,209 63,210 LED6.DI
N$6  (via drill 0.35)
  Top 0.406: LED6.DO v62,206.51 | v22.5,190 LED7.DI
  Bottom 0.406: v62,206.51 41.51,206.51 40,205 40,191 39,190 v22.5,190
N$7
  Top 0.406: LED7.DO 21.2,188.3 21.5,188 57,188 59.98,185.02 65.36,185.02 67,186.65 67,189 66,190 LED8.DI
N$8  (via drill 0.35)
  Top 0.406: LED8.DO v64,186 | v20,170 LED9.DI
  Bottom 0.406: v64,186 41,186 40,185 40,171 39,170 v20,170
N$9
  Top 0.406: LED9.DO 18.7,168.3 19,168 59,168 62,165 67,165 68,166 68,169 67,170 LED10.DI
N$10  (via drill 0.35)
  Top 0.406: LED10.DO v66,166 | v18.5,150 LED11.DI
  Bottom 0.406: v18.5,150 39,150 40,151 40,165 41,166 v66,166
N$11
  Top 0.406: LED11.DO 17.2,148.3 17.5,148 61,148 64,145 69,145 70,146 70,149 69,150 LED12.DI
N$12  (via drill 0.35)
  Top 0.406: LED12.DO v68,146 | v16,130 LED13.DI
  Bottom 0.406: v16,130 39,130 40,131 40,145 41,146 v68,146
N$13
  Top 0.406: LED13.DO 14.7,128.3 15,128 63,128 66,125 71,125 72,126 72,129 71,130 LED14.DI
N$14  (via drill 0.35)
  Top 0.406: LED14.DO v70,126 | v14.5,110 LED15.DI
  Bottom 0.406: v70,126 41,126 40,125 40,111 39,110 v14.5,110
N$15
  Top 0.406: LED15.DO 12.2,108.3 12.5,108 62,108 65,105 73,105 74,106 74,109 73,110 LED16.DI
N$16  (via drill 0.35)
  Top 0.406: LED16.DO v72,106 | v12,90 LED17.DI
  Bottom 0.406: v72,106 41,106 40,105 40,91 39,90 v12,90
N$17
  Top 0.406: LED17.DO 10.7,88.3 11,88 64,88 66.63,85.37 71.11,85.37 72.38,86.64 72.38,89.18 73.2,90 LED18.DI
N$18  (via drill 0.35)
  Top 0.406: LED18.DO v74,86 | v11.5,70 LED19.DI
  Bottom 0.406: v74,86 41,86 40,85 40,71 39,70 v11.5,70
N$19
  Top 0.406: LED19.DO 10.2,68.3 10.5,68 66,68 69,65 72.97,65 74.29,66.32 74.29,69.5 74.8,70 LED20.DI
N$20  (via drill 0.35)
  Top 0.406: LED20.DO 76,67 v77,66 | LED21.DI v17,44.46
  Bottom 0.406: v77,66 76,67 42,67 40,65 40,45.46 39,44.46 v17,44.46
N$21
  Top 0.406: LED21.DO 16.7,42.76 17,42.46 61,42.46 62.24,41.22 70.75,41.22 72,42.48 72,43.46 71,44.46 LED22.DI
N$22  (via drill 0.35)
  Top 0.406: v40,34 LED23.DI | v71,42.46 70.7,42.76 LED22.DO
  Bottom 0.406: v71,42.46 41,42.46 40,41.46 v40,34
N$23
  Top 0.406: LED23.DO 43,32 44,31 44,20 43,19 41,19 40,18 LED24.DI
N$24
  Top 0.406: CHG.C 27.5,276.29 R2.1
N$25
  Top 0.406: U3.1 27.2,274.29 R2.2
N$26
  Top 0.305: R9.2 53.97,290.69 53.97,280.95 52.06,279.05 U1.2
N$27
  Top 0.406: R4.2 21.69,274.29 U3.5
N$28  (via drill 0.35)
  Top 0.305: J1.3 19.05,266.98 20.32,266.98 21.59,265.71 v32.38,265.71 | U1.5 v48.26,266.98 48.89,266.35 52.37,266.35 55.54,269.52 U4.5
  Bottom 0.305: v32.38,265.71 46.98,265.71 v48.26,266.98
N$29  (via drill 0.35)
  Top 0.305: J1.2 19.05,267.62 20.95,267.62 21.59,266.98 v32.38,266.98 | U1.6 v46.98,267.62 46.98,266.35 47.62,265.71 52.7,265.71 55.86,268.87 U4.6
  Bottom 0.305: v32.38,266.98 46.35,266.98 v46.98,267.62
N$30
  Top 0.305: R8.2 60.95,261.9 62.59,263.53 Q1.1
N$31
  Top 0.305: R6.2 60.95,263.81 61.59,264.44 61.59,266.98 62.23,267.62 62.23,269.52 61.27,270.47 Q2.1
N$32
  Top 0.305: R11.2 54.61,293.01 54.82,292.8 54.82,269.74 52.7,267.62 51.43,267.62 50.8,268.25 U1.3
N$33
  Top 0.406: D3.A 35.99,274.19 R10.2
N$34  (via drill 0.35)
  Top 0.61: Q3.2 24.76,269.47 | 24.76,269.47 v24.76,268.88 | 24.76,269.47 25.4,269.47 D4.C
  Bottom 0.61: v24.76,268.88 24.76,243.49 24.12,242.85 18.99,242.85 U5.2
NEOPIX3V3  (via drill 0.25)
  Top 0.305: X2.9 30.74,287.08 29.62,287.08 29.2,286.67 v29.2,286.03 | v29.84,252.38 33.02,252.38 33.51,251.88 U6.3
  Bottom 0.305: v29.2,286.03 29.2,285.39 29.84,284.76 v29.84,252.38
NEOPIX5V
  Top 0.305: LED1.DI 27.77,250 27.94,249.84 27.94,248.56 28.57,247.93 33.02,247.93 33.51,248.42 U6.4
RESET  (via drill 0.25)
  Top 0.305: SW2.B' v40,263.97 SW2.B 37.9,264.02 C31.1 31.53,264.02 v31.11,264.44 | R5.2 56.3,266.76 v55.24,265.71 55.88,265.07 Q1.3 | X2.3 30.89,294.7 v30.48,294.29
  Bottom 0.305: v40,263.97 48.42,263.97 50.16,265.71 v55.24,265.71 | v30.48,294.29 31.11,293.65 v31.11,264.44
RTS  (via drill 0.25)
  Top 0.305: U1.14 50.8,263.17 51.43,262.53 53.97,262.53 v54.61,263.17 55.24,263.81 R6.1 | v62.86,266.98 62.59,266.71 Q1.2
  Bottom 0.305: v54.61,263.17 60.95,263.17 62.86,265.07 v62.86,266.98
RXD0
  Top 0.305: X2.34 49.74,292.16 50.8,291.11 R9.1
SAO_IO1  (via drill 0.35)
  Top 0.406: X2.27 52.48,283.27 v52.7,283.49 | J2.5 42.29,242.13 v42.29,243.1
  Bottom 0.406: v52.7,283.49 55.88,283.49 57.02,282.35 57.02,274.35 59.05,272.31 64.13,272.31 65.4,269.01 63.37,261.14 63.37,246.91 59.56,243.1 v42.29,243.1
SAO_IO2  (via drill 0.35)
  Top 0.406: X2.28 52.48,284.54 v52.7,284.76 | J2.6 45.08,237.64 v45.08,238.02
  Bottom 0.406: v52.7,284.76 56,284.76 58.03,282.73 58.03,274.35 59.3,273.08 64.64,273.08 66.42,268.76 64.38,261.14 64.38,246.66 60.07,242.34 49.4,242.34 v45.08,238.02
SCL
  Top 0.406: X2.36 56.09,294.7 57.17,293.62 57.17,274.35 58.8,272.72 64.32,272.72 65.88,269.09 63.5,259.7 63.5,246.66 59.69,242.85 46.35,242.85 45.08,244.12 40,244.12 37.46,241.58 37.46,239.97 J2.4
SDA
  Top 0.406: X2.37 56.09,295.97 57.78,294.29 57.78,275.24 59.69,273.33 64.77,273.33 66.57,269.12 64.13,259.36 64.13,246.03 60.32,242.22 46.35,242.22 43.17,239.04 40.34,239.04 J2.3
TXD0
  Top 0.305: X2.35 50.38,293.43 50.8,293.01 R11.1
VBAT  (via drill 0.35, 0.4)
  Top 0.406: U3.3 23.81,276.19 | C28.1 22.54,277.45 23.81,276.19 | 23.81,276.19 23.49,275.87 23.49,273.33 24.12,272.69 | Q3.3 23.49,272.06 | R1.2 v22.22,289.84
  Top 0.61: 23.49,272.06 24.12,272.69 v24.76,272.69
  Bottom 0.406: v22.22,289.84 22.22,273.33 22.86,272.69 v24.76,272.69
  Bottom 0.61: 9.8,61.88 3.8,61.88 1.99,63.69 14.6,235.23 15.87,236.5 22.22,236.5 26.03,240.31 26.03,272.06 25.39,272.69 v24.76,272.69
  Bottom 0.813: U$9.P$1 9.8,61.88
VBUS  (via drill 0.25, 0.35)
  Top 0.305: D4.A v32.38,270.79 | U4.4 56.21,271.09 v55.88,271.43
  Top 0.406: J1.1 18.41,268.25 19.68,269.52 | CHG.A 29.2,273.33 30.42,272.12 D4.A 30.42,270.74 29.2,269.52 28.57,269.52 28.36,269.31 R12.2 27.72,267.62 23.45,267.62 22.54,268.52 Q3.1 22.27,269.52 19.68,269.52 | U3.4 21.27,276.19 18.08,273 18,273 | 18,273 C32.1 | 18,273 19,272 19,270.2 19.68,269.52
  Bottom 0.305: v55.88,271.43 33.02,271.43 v32.38,270.79
VDD  (via drill 0.35, 0.4)
  Top 0.406: C8.1 50.08,250.93 51,250 LED2.LEDVDD 55.44,250 55.91,250.47 55.91,250.98 56.63,251.7 LED2.VDD | C5.1 53.15,230.85 54,230 LED4.LEDVDD 57.5,230 57.91,230.4 57.91,231.17 58.44,231.7 LED4.VDD | C7.1 26.85,231 24.3,231 LED3.VDD 22.37,230.7 22.09,230.42 22.09,229.66 21.44,229 LED3.LEDVDD | C3.1 55.15,210.85 56,210 LED6.LEDVDD 59.57,210 59.91,210.34 59.91,211.1 60.51,211.7 LED6.VDD | C4.1 25.35,212 22.3,212 LED5.VDD 21.91,211.61 20.44,211.61 19.93,211.1 19.93,210.34 19.6,210 LED5.LEDVDD | C17.1 16.85,132 14.3,132 LED13.VDD 12.2,131.7 11.84,131.34 11.84,130.58 11.33,130.07 10.07,130.07 LED13.LEDVDD | C16.1 63.15,130.85 64,130 LED14.LEDVDD 67.58,130 67.91,130.33 67.91,131.34 68.26,131.7 LED14.VDD | C20.1 19.35,152 16.3,152 LED11.VDD 15.96,151.66 14.6,151.66 14.09,151.16 14.09,150.39 13.7,150 LED11.LEDVDD | C19.1 61.15,150.85 62,150 LED12.LEDVDD 65.51,150 65.91,150.39 65.91,151.41 66.2,151.7 LED12.VDD | C14.1 65.15,110.85 66,110 LED16.LEDVDD 69.65,110.01 69.91,110.26 69.91,111.28 70.33,111.7 LED16.VDD | C10.1 67.15,90.85 68,90 LED18.LEDVDD 71.46,90 71.91,90.45 71.91,91.21 72.39,91.7 LED18.VDD | C6.1 69.15,70.85 70,70 LED20.LEDVDD 73.52,70 73.91,70.38 73.91,71.15 74.46,71.7 LED20.VDD | C23.1 39.15,9.38 40,10.23 LED24.LEDVDD 40,13.37 40,13.63 39.49,14.14 38.73,14.14 38.3,14.57 LED24.VDD | C18.1 38,34.85 38,32.3 LED23.VDD 38.3,30.53 38.99,29.84 39.75,29.84 40,29.59 40,29.08 LED23.LEDVDD | C1.1 12.35,72 v11.5,72 9.3,72 LED19.VDD 8.95,71.65 7.49,71.65 6.98,71.15 6.98,70.38 6.6,70 LED19.LEDVDD | C12.1 12.85,92 v12,92 10.3,92 LED17.VDD 8.33,91.7 8.09,91.47 8.09,90.45 7.64,90 LED17.LEDVDD
  Top 0.406: C15.1 15.35,112 v14.5,112 12.3,112 LED15.VDD 10.45,111.7 10.03,111.28 10.03,110.26 9.77,110.01 LED15.LEDVDD | C2.1 23.35,192 20.3,192 LED7.VDD 18.31,191.7 17.9,191.29 17.9,190.27 17.63,190 LED7.LEDVDD | C22.1 20.85,172 18.3,172 LED9.VDD 16.57,171.7 16.09,171.22 16.09,170.71 15.38,170 LED9.LEDVDD | LED21.LEDVDD 11.03,44.49 12.58,44.49 13.08,44.98 13.08,45.49 13.58,46 14.84,46 LED21.VDD 18.15,46.16 C11.1 | LED10.VDD 64.13,171.7 63.91,171.48 63.91,170.21 63.7,170 LED10.LEDVDD 60.3,170 59.45,170.85 C21.1 | LED8.VDD 62.32,191.7 61.91,191.29 61.91,190.53 61.38,190 LED8.LEDVDD 58.11,190 57.26,190.85 C24.1 | LED1.LEDVDD 23.37,250 23.84,250.47 23.84,251.23 24.31,251.7 LED1.VDD 29.15,251.7 C9.1 | R7.2 26.56,282.54 U2.1
  Top 0.61: R7.2 27.3,282 v27.3,281.58 28.26,282.54 C25.1
  Bottom 0.61: v27.3,281.58 v27.3,258.09 | U5.1 20.67,239.96 v20.95,239.68
  pour Top (isolate 0.203): -4.45,259.74 -4.45,-0.99 81.91,-0.99 81.91,259.74

### Text on the board
tPlace: FLAG-Z35XD8URP3 | SAO | NORTHSEC 2022 PROTO V3f
bPlace: FLAG-4XZRY8H3DK
tDocu: CHANGE LOG V3e -> V3f / - move switch / - added level converter / - added flags
Stiffner: Stiffener BOT | Note: / Flexible PCB 0.2mm FPC / Stiffener 0.8mm FR4 | STIFFNER CUTOUT / FOR SWITCH | Stiffener BOT | Stiffener BOT | Stiffener BOT | Stiffener BOT | Stiffener BOT | Stiffener BOT | Stiffener BOT | Stiffener BOT | Stiffener BOT